# Altium schematic sheet PI_R3_REV1_BLOCK_CAP.SchDoc
size 100 x 100 mm
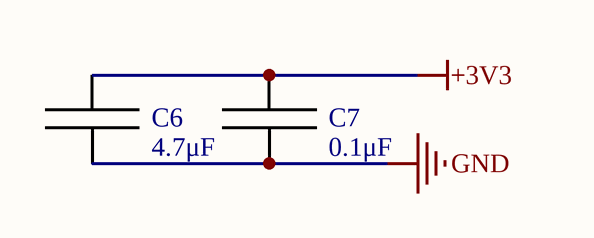
[diagram p0: PI_R3_REV1_BLOCK_CAP.SchDoc]

## Parts
C6  value 4.7μF  [CAP: 0402]  (hidden comment: Cap_0402)
C7  value 0.1μF  [CAP: 0402]  (hidden comment: Cap_0402)

## Nets
+3V3: C6.2 C7.2
GND: C6.1 C7.1

## Library data of the parts
C6 C7 = Cap_0402: TypeDielectric: X7R(X5R); Voltage: ??V; Package/Case: 0402; Temperature: -55...+125°C(-55...+85°C); Product Category: Capacitors